# Altium schematic sheet subsystem_intro_prj_archive.SchDoc
size A; SheetNumber: 1; SheetTotal: 1
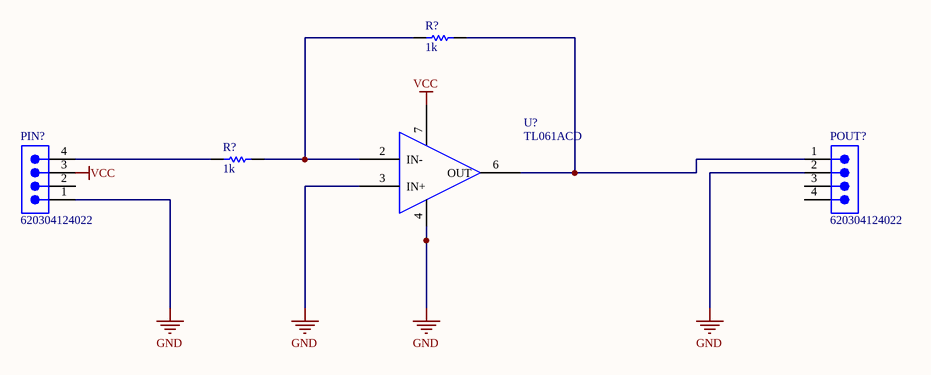
[diagram p0: subsystem_intro_prj_archive.SchDoc]

## Parts
(Parts that share a designator on the sheet are numbered #1, #2 ... from top to bottom, then left to right.)
PIN?  620304124022  [620304124022]
POUT?  620304124022  [620304124022]
R?#1  1k  [RESC2013X60X35ML10T20]
R?#2  1k  [RESC2013X60X35ML10T20]
U?  TL061ACD  [TL061ACD]

## Nets
GND: PIN?.1 POUT?.2 U?.3(IN+) U?.4(VCC-)
VCC: PIN?.3 U?.7(VCC+)
NetPIN?_4: PIN?.4 R?#2.1
NetPOUT?_1: POUT?.1 R?#1.2 U?.6(OUT)
NetR?#1_1: R?#1.1 R?#2.2 U?.2(IN-)

Not connected (* = marked no-connect by the designer): PIN? 2; POUT? 3 4

## Library data of the parts
PIN? POUT? = CMP-1502-00662-2: NexarPartId: 18818244; Insulation: Insulated; Number of Contacts: 4; Connector Type: Male Pin; Contact Resistance: 20mΩ; Current Rating: 2A; Insulation Resistance: 1GΩ; Operating Supply Voltage: 100V; Pitch: 2mm; Voltage Rating: 125V; Gender: Male; Packaging: Tape and Reel; Number of Rows: 1; Height: 6.6mm; Width: 11.9mm; Number of Pins: 4; Contact Plating: Tin; Contact Mating Length: 3.5052mm; Flammability Rating: UL94 V-0; Color: Beige, White; Contact Gender: Male; Orientation: Vertical; Contact Material: Copper; Max Operating Temperature: 85°C; RoHS: Compliant; Number of Positions: 4; Lead Pitch: 2mm; Min Operating Temperature: -40°C; Length: 9mm; Termination: SMD/SMT; Housing Material: Nylon; REACH SVHC: Unknown; Lead Free: Lead Free; Mount: Surface Mount
R?#1 R?#2 = CMP-2100-03671-1: Chip Resistor, 1 KOhm, +/- 1%, 125 mW, -55 to 155 degC, 0805 (2012 Metric), RoHS, Tape and Reel; Manufacturer: Yageo; Temperature Coefficient: 100ppm/degreesC; Voltage Rating (DC): 150V; Max Power Dissipation: 125mW; Resistance: 1KOhm; Number of Pins: 2; Number of Terminations: 2; Datasheet URL: http://www.yageo.com/NewPortal/yageodocoutput?fileName=/pdf/R-Chip/PYu-RC_Group_51_RoHS_L_5.pdf; Length: 0.079inch; Package Description: 2-Pin Surface Mounted Device, Body 2 x 1.25 mm; Depth: 1.25mm; Height: 0.024inch; Military Standard: Not; Case/Package: 0805; Package Reference: 0805; RoHSCompliant: true; Lead Free: LeadFree; Packaging: TapeandReel; Package Quantity: 1; Datasheet Version: Rev. 5, 10/2016; Tolerance: 1%; Min Operating Temperature: -55degC; Voltage Rating: 150V; Composition: ThickFilm; Case Code (Imperial): 0805; Power Rating: 125mW; Width: 0.049inch; Case Code (Metric): 2012; Manufacturer URL: http://www.yageo.com/; Max Operating Temperature: 155degC; REACH SVHC: Unknown; Termination: SMD/SMT